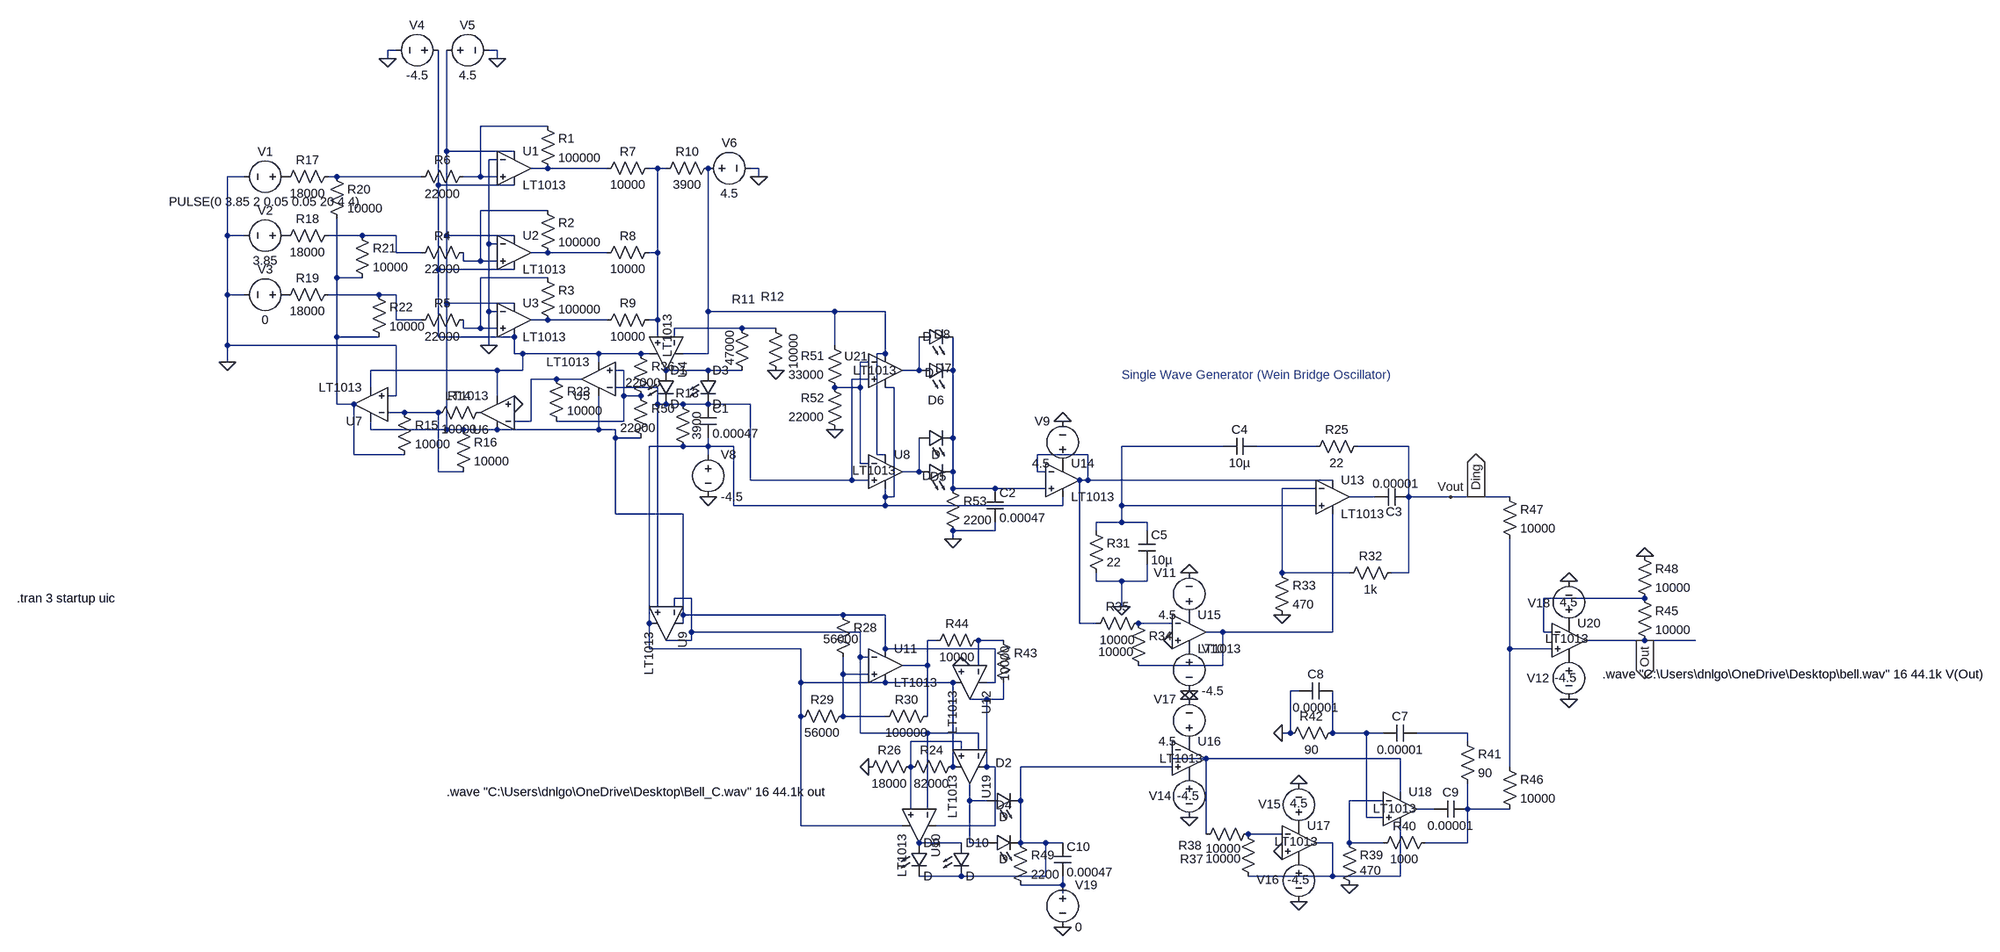
[diagram p0: schematic Project_2_C.asc]
Project_2_C.asc, the LTspice schematic file:
Version 4
SHEET 1 2804 1236
WIRE -336 -640 -352 -640
WIRE -144 -640 -160 -640
WIRE -352 -624 -352 -640
WIRE -144 -624 -144 -640
WIRE -48 -496 -176 -496
WIRE -240 -448 -240 -640
WIRE -112 -448 -240 -448
WIRE -144 -432 -160 -432
WIRE -48 -416 -80 -416
WIRE 64 -416 -48 -416
WIRE 160 -416 144 -416
WIRE 176 -416 160 -416
WIRE 352 -416 336 -416
WIRE -624 -400 -656 -400
WIRE -448 -400 -464 -400
WIRE -288 -400 -448 -400
WIRE -176 -400 -176 -496
WIRE -176 -400 -208 -400
WIRE -144 -400 -176 -400
WIRE 352 -400 352 -416
WIRE -256 -384 -256 -640
WIRE -112 -384 -256 -384
WIRE -48 -336 -176 -336
WIRE -656 -288 -656 -400
WIRE -624 -288 -656 -288
WIRE -400 -288 -464 -288
WIRE -336 -288 -400 -288
WIRE -240 -288 -240 -448
WIRE -112 -288 -240 -288
WIRE -160 -272 -160 -432
WIRE -144 -272 -160 -272
WIRE -336 -256 -336 -288
WIRE -288 -256 -336 -256
WIRE -48 -256 -80 -256
WIRE 64 -256 -48 -256
WIRE 160 -256 160 -416
WIRE 160 -256 144 -256
WIRE -208 -240 -208 -256
WIRE -176 -240 -176 -336
WIRE -176 -240 -208 -240
WIRE -144 -240 -176 -240
WIRE -256 -224 -256 -384
WIRE -112 -224 -256 -224
WIRE -448 -208 -448 -320
WIRE -400 -208 -448 -208
WIRE -48 -208 -176 -208
WIRE -656 -176 -656 -288
WIRE -624 -176 -656 -176
WIRE -368 -176 -464 -176
WIRE -336 -176 -368 -176
WIRE -240 -160 -240 -288
WIRE -112 -160 -240 -160
WIRE -160 -144 -160 -272
WIRE -144 -144 -160 -144
WIRE 256 -144 256 -416
WIRE 496 -144 256 -144
WIRE 592 -144 496 -144
WIRE -336 -128 -336 -176
WIRE -288 -128 -336 -128
WIRE -48 -128 -80 -128
WIRE 64 -128 -48 -128
WIRE 160 -128 160 -256
WIRE 160 -128 144 -128
WIRE -208 -112 -208 -128
WIRE -176 -112 -176 -208
WIRE -176 -112 -208 -112
WIRE -144 -112 -176 -112
WIRE 320 -112 192 -112
WIRE 384 -112 320 -112
WIRE -448 -96 -448 -208
WIRE -368 -96 -448 -96
WIRE -256 -96 -256 -224
WIRE -112 -96 -256 -96
WIRE 160 -96 160 -128
WIRE 192 -96 192 -112
WIRE -656 -80 -656 -176
WIRE -336 -80 -656 -80
WIRE -160 -80 -160 -144
WIRE 496 -80 496 -144
WIRE -112 -64 -112 -96
WIRE -96 -64 -112 -64
WIRE 48 -64 -96 -64
WIRE 128 -64 48 -64
WIRE 144 -64 128 -64
WIRE 256 -64 256 -144
WIRE 256 -64 208 -64
WIRE 592 -64 592 -144
WIRE 592 -64 576 -64
WIRE -656 -48 -656 -80
WIRE 48 -48 48 -64
WIRE 560 -48 544 -48
WIRE -144 -32 -384 -32
WIRE -96 -32 -96 -64
WIRE -96 -32 -144 -32
WIRE 96 -32 80 -32
WIRE 256 -32 176 -32
WIRE 320 -32 256 -32
WIRE 656 -32 656 -96
WIRE 656 -32 624 -32
WIRE 720 -32 720 -96
WIRE -32 -16 -80 -16
WIRE 16 -16 -32 -16
WIRE 560 -16 528 -16
WIRE -384 0 -384 -32
WIRE 160 0 80 0
WIRE 544 0 544 -48
WIRE 544 0 496 0
WIRE 608 0 592 0
WIRE -336 16 -336 -80
WIRE -336 16 -352 16
WIRE -144 16 -144 -32
WIRE 96 16 96 -32
WIRE 128 16 96 16
WIRE -448 32 -448 -96
WIRE -416 32 -448 32
WIRE 160 32 160 0
WIRE 176 32 160 32
WIRE 208 32 176 32
WIRE 256 32 208 32
WIRE 336 32 256 32
WIRE -320 48 -352 48
WIRE -256 48 -320 48
WIRE -80 64 -80 -16
WIRE -80 64 -112 64
WIRE 96 64 96 16
WIRE 96 64 -32 64
WIRE -384 80 -384 64
WIRE -240 80 -240 -160
WIRE -240 80 -384 80
WIRE -208 80 -240 80
WIRE -144 80 -208 80
WIRE 48 80 48 16
WIRE 48 80 -144 80
WIRE 80 80 48 80
WIRE 80 96 80 80
WIRE 128 96 80 96
WIRE 720 96 720 -32
WIRE 208 112 144 112
WIRE 256 112 256 96
WIRE 256 112 208 112
WIRE 304 112 256 112
WIRE 1232 112 1040 112
WIRE 1408 112 1296 112
WIRE 1584 112 1488 112
WIRE -416 128 -416 32
WIRE -320 128 -416 128
WIRE 256 128 256 112
WIRE 576 128 576 -64
WIRE 592 128 576 128
WIRE 976 128 880 128
WIRE 544 144 544 0
WIRE 560 144 544 144
WIRE -256 160 -256 48
WIRE -208 160 -256 160
WIRE 656 160 656 96
WIRE 656 160 624 160
WIRE 720 160 720 96
WIRE 880 160 880 128
WIRE 896 160 880 160
WIRE 336 176 336 32
WIRE 528 176 528 -16
WIRE 528 176 336 176
WIRE 560 176 528 176
WIRE 976 176 976 128
WIRE 976 176 960 176
WIRE 1440 176 976 176
WIRE 720 192 720 160
WIRE 800 192 720 192
WIRE 896 192 800 192
WIRE 1408 192 1344 192
WIRE 592 208 592 192
WIRE 608 208 608 0
WIRE 608 208 592 208
WIRE 1520 208 1472 208
WIRE 1584 208 1584 112
WIRE 1664 208 1584 208
WIRE 1712 208 1664 208
WIRE 1776 208 1712 208
WIRE 304 224 304 112
WIRE 592 224 592 208
WIRE 592 224 304 224
WIRE 928 224 928 208
WIRE 928 224 592 224
WIRE 1040 224 1040 112
WIRE 1408 224 1040 224
WIRE 80 240 80 96
WIRE 208 240 80 240
WIRE 1040 256 1040 224
WIRE 1040 256 992 256
WIRE 1088 256 1040 256
WIRE 800 272 800 256
WIRE 800 272 720 272
WIRE 992 272 992 256
WIRE 1088 272 1088 256
WIRE 720 288 720 272
WIRE 1344 352 1344 192
WIRE 1472 352 1344 352
WIRE 1584 352 1584 208
WIRE 1584 352 1552 352
WIRE 992 368 992 352
WIRE 1040 368 992 368
WIRE 1088 368 1088 336
WIRE 1088 368 1040 368
WIRE 224 400 192 400
WIRE 2032 400 1840 400
WIRE 160 416 160 32
WIRE 192 416 192 400
WIRE 1040 416 1040 368
WIRE 208 432 208 240
WIRE 512 432 208 432
WIRE 592 432 512 432
WIRE 144 448 144 112
WIRE 208 448 208 432
WIRE 960 448 960 176
WIRE 992 448 960 448
WIRE 1136 448 1072 448
WIRE 224 464 224 400
WIRE 544 464 224 464
WIRE 1232 464 1200 464
WIRE 1440 464 1440 240
WIRE 1440 464 1232 464
WIRE 1840 464 1840 400
WIRE 1856 464 1840 464
WIRE 224 480 224 464
WIRE 224 480 176 480
WIRE 688 480 672 480
WIRE 816 480 768 480
WIRE 2032 480 1920 480
WIRE 2128 480 2032 480
WIRE 144 496 144 448
WIRE 432 496 144 496
WIRE 592 496 592 432
WIRE 800 496 592 496
WIRE 1776 496 1776 288
WIRE 1856 496 1776 496
WIRE 544 512 544 464
WIRE 560 512 544 512
WIRE 672 528 672 480
WIRE 672 528 624 528
WIRE 768 528 768 480
WIRE 1232 528 1232 464
WIRE 1232 528 1072 528
WIRE 512 544 512 512
WIRE 560 544 512 544
WIRE 432 560 432 496
WIRE 592 560 432 560
WIRE 720 560 592 560
WIRE 800 560 800 496
WIRE 800 560 784 560
WIRE 1376 576 1360 576
WIRE 784 592 752 592
WIRE 816 592 816 560
WIRE 816 592 784 592
WIRE 432 624 432 560
WIRE 512 624 512 544
WIRE 592 624 512 624
WIRE 672 624 672 528
WIRE 544 656 544 512
WIRE 672 656 544 656
WIRE 768 656 672 656
WIRE 1360 656 1360 576
WIRE 1360 656 1344 656
WIRE 1440 656 1440 576
WIRE 1504 656 1440 656
WIRE 1536 656 1504 656
WIRE 1696 656 1600 656
WIRE 736 672 640 672
WIRE 1696 672 1696 656
WIRE 736 688 736 672
WIRE 768 688 768 656
WIRE 1136 704 1136 688
WIRE 1200 704 1136 704
WIRE 1568 704 1200 704
WIRE 640 720 640 672
WIRE 720 720 720 560
WIRE 784 720 784 592
WIRE 800 720 784 720
WIRE 1136 720 848 720
WIRE 1776 720 1776 496
WIRE 1568 768 1568 704
WIRE 752 784 752 752
WIRE 784 784 752 784
WIRE 848 784 848 720
WIRE 1536 784 1472 784
WIRE 640 800 640 720
WIRE 672 800 672 656
WIRE 1632 800 1600 800
WIRE 1696 800 1696 752
WIRE 1776 800 1696 800
WIRE 1504 816 1504 656
WIRE 1536 816 1504 816
WIRE 432 832 432 624
WIRE 624 832 432 832
WIRE 800 832 800 720
WIRE 800 832 688 832
WIRE 1200 848 1200 704
WIRE 1344 848 1280 848
WIRE 736 864 656 864
WIRE 752 864 752 784
WIRE 784 864 752 864
WIRE 848 864 848 784
WIRE 896 864 848 864
WIRE 928 864 896 864
WIRE 1440 864 1408 864
WIRE 1472 864 1472 784
WIRE 1536 864 1472 864
WIRE 1696 864 1696 800
WIRE 1696 864 1616 864
WIRE 736 928 656 928
WIRE 896 928 896 864
WIRE 896 928 736 928
WIRE 1440 928 1440 864
WIRE 1440 928 1280 928
WIRE 1568 928 1568 832
WIRE 1568 928 1440 928
WIRE 928 944 928 928
WIRE 928 944 848 944
WIRE 928 960 928 944
FLAG -656 -48 0
FLAG -352 -624 0
FLAG -144 -624 0
FLAG -160 -80 0
FLAG 352 -400 0
FLAG 384 -32 0
FLAG 256 208 0
FLAG 1040 416 0
FLAG 1344 432 0
FLAG 1664 208 Vout
FLAG 928 64 0
FLAG 1168 576 0
FLAG 1168 352 0
FLAG 1136 480 0
FLAG 1168 592 0
FLAG 1472 944 0
FLAG 1344 656 0
FLAG 736 528 0
FLAG 1888 592 0
FLAG 1888 368 0
FLAG 2032 320 0
FLAG 1168 816 0
FLAG 1376 752 0
FLAG 1376 976 0
FLAG 1344 880 0
FLAG 928 1024 0
FLAG 2032 480 Out
IOPIN 2032 480 Out
FLAG -112 32 0
FLAG 1712 208 Ding
IOPIN 1712 208 Out
FLAG 496 80 0
FLAG 720 288 0
FLAG 560 720 0
DATAFLAG 160 208 ""
SYMBOL voltage -528 -400 R90
WINDOW 0 -32 56 VBottom 2
WINDOW 3 32 56 VTop 2
WINDOW 123 0 0 Left 0
WINDOW 39 0 0 Left 0
SYMATTR InstName V1
SYMATTR Value PULSE(0 3.85 2 0.05 0.05 20 4 4)
SYMBOL voltage -528 -288 R90
WINDOW 0 -32 56 VBottom 2
WINDOW 3 32 56 VTop 2
WINDOW 123 0 0 Left 0
WINDOW 39 0 0 Left 0
SYMATTR InstName V2
SYMATTR Value 3.85
SYMBOL voltage -528 -176 R90
WINDOW 0 -32 56 VBottom 2
WINDOW 3 32 56 VTop 2
SYMATTR InstName V3
SYMATTR Value 0
SYMBOL OpAmps\\LT1013 -112 -480 R0
SYMATTR InstName U1
SYMBOL OpAmps\\LT1013 -112 -320 R0
SYMATTR InstName U2
SYMBOL OpAmps\\LT1013 -112 -192 R0
SYMATTR InstName U3
SYMBOL voltage -240 -640 R90
WINDOW 0 -32 56 VBottom 2
WINDOW 3 32 56 VTop 2
WINDOW 123 0 0 Left 0
WINDOW 39 0 0 Left 0
SYMATTR InstName V4
SYMATTR Value -4.5
SYMBOL voltage -256 -640 R270
WINDOW 0 32 56 VTop 2
WINDOW 3 -32 56 VBottom 2
WINDOW 123 0 0 Left 0
WINDOW 39 0 0 Left 0
SYMATTR InstName V5
SYMATTR Value 4.5
SYMBOL res -64 -512 R0
SYMATTR InstName R1
SYMATTR Value 100000
SYMBOL res -64 -352 R0
SYMATTR InstName R2
SYMATTR Value 100000
SYMBOL res -64 -224 R0
SYMATTR InstName R3
SYMATTR Value 100000
SYMBOL res -192 -272 R90
WINDOW 0 0 56 VBottom 2
WINDOW 3 32 56 VTop 2
SYMATTR InstName R4
SYMATTR Value 22000
SYMBOL res -192 -144 R90
WINDOW 0 0 56 VBottom 2
WINDOW 3 32 56 VTop 2
SYMATTR InstName R5
SYMATTR Value 22000
SYMBOL res -192 -416 R90
WINDOW 0 0 56 VBottom 2
WINDOW 3 33 56 VTop 2
SYMATTR InstName R6
SYMATTR Value 22000
SYMBOL res 160 -432 R90
WINDOW 0 0 56 VBottom 2
WINDOW 3 32 56 VTop 2
SYMATTR InstName R7
SYMATTR Value 10000
SYMBOL res 160 -272 R90
WINDOW 0 0 56 VBottom 2
WINDOW 3 32 56 VTop 2
SYMATTR InstName R8
SYMATTR Value 10000
SYMBOL res 160 -144 R90
WINDOW 0 0 56 VBottom 2
WINDOW 3 32 56 VTop 2
SYMATTR InstName R9
SYMATTR Value 10000
SYMBOL res 272 -432 R90
WINDOW 0 0 56 VBottom 2
WINDOW 3 32 56 VTop 2
SYMATTR InstName R10
SYMATTR Value 3900
SYMBOL voltage 240 -416 R270
WINDOW 0 32 56 VTop 2
WINDOW 3 -32 56 VBottom 2
SYMATTR InstName V6
SYMATTR Value 4.5
SYMBOL OpAmps\\LT1013 240 -64 R90
WINDOW 3 -75 61 Left 2
SYMATTR InstName U4
SYMBOL res 336 -16 R180
WINDOW 0 -9 151 Left 2
WINDOW 3 39 93 VLeft 2
SYMATTR InstName R11
SYMATTR Value 47000
SYMBOL res 400 -16 R180
WINDOW 0 0 156 Left 2
WINDOW 3 -18 86 VLeft 2
SYMATTR InstName R12
SYMATTR Value 10000
SYMBOL cap 240 32 R0
SYMATTR InstName C1
SYMATTR Value 0.00047
SYMBOL res 192 16 R0
WINDOW 0 2 -5 Left 2
WINDOW 3 43 84 VLeft 2
SYMATTR InstName R13
SYMATTR Value 3900
SYMBOL OpAmps\\LT1013 -384 96 R180
SYMATTR InstName U7
SYMBOL res -336 32 R0
SYMATTR InstName R15
SYMATTR Value 10000
SYMBOL res -224 64 R0
SYMATTR InstName R16
SYMATTR Value 10000
SYMBOL res -448 -416 R90
WINDOW 0 0 56 VBottom 2
WINDOW 3 32 56 VTop 2
SYMATTR InstName R17
SYMATTR Value 18000
SYMBOL res -448 -304 R90
WINDOW 0 0 56 VBottom 2
WINDOW 3 32 56 VTop 2
SYMATTR InstName R18
SYMATTR Value 18000
SYMBOL res -448 -192 R90
WINDOW 0 0 56 VBottom 2
WINDOW 3 32 56 VTop 2
SYMATTR InstName R19
SYMATTR Value 18000
SYMBOL res -464 -416 R0
SYMATTR InstName R20
SYMATTR Value 10000
SYMBOL res -416 -304 R0
SYMATTR InstName R21
SYMATTR Value 10000
SYMBOL res -384 -192 R0
SYMATTR InstName R22
SYMATTR Value 10000
SYMBOL voltage 256 112 R0
SYMATTR InstName V8
SYMATTR Value -4.5
SYMBOL OpAmps\\LT1013 240 448 R90
SYMATTR InstName U9
SYMBOL cap 1296 96 R90
WINDOW 0 0 32 VBottom 2
WINDOW 3 32 32 VTop 2
SYMATTR InstName C4
SYMATTR Value 10µ
SYMBOL res 1504 96 R90
WINDOW 0 0 56 VBottom 2
WINDOW 3 32 56 VTop 2
SYMATTR InstName R25
SYMATTR Value 22
SYMBOL cap 1072 272 R0
SYMATTR InstName C5
SYMATTR Value 10µ
SYMBOL res 976 256 R0
SYMATTR InstName R31
SYMATTR Value 22
SYMBOL res 1568 336 R90
WINDOW 0 0 56 VBottom 2
WINDOW 3 32 56 VTop 2
SYMATTR InstName R32
SYMATTR Value 1k
SYMBOL OpAmps\\LT1013 1440 144 R0
SYMATTR InstName U13
SYMBOL OpAmps\\LT1013 928 112 R0
SYMATTR InstName U14
SYMBOL voltage 928 160 R180
WINDOW 0 24 96 Left 2
WINDOW 3 24 16 Left 2
SYMATTR InstName V9
SYMATTR Value 4.5
SYMBOL OpAmps\\LT1013 1168 400 R0
SYMATTR InstName U15
SYMBOL voltage 1168 480 R0
SYMATTR InstName V10
SYMATTR Value -4.5
SYMBOL voltage 1168 448 R180
WINDOW 0 24 96 Left 2
WINDOW 3 24 16 Left 2
SYMATTR InstName V11
SYMATTR Value 4.5
SYMBOL res 1328 336 R0
SYMATTR InstName R33
SYMATTR Value 470
SYMBOL res 1056 432 R0
WINDOW 3 -60 70 Left 2
SYMATTR Value 10000
SYMATTR InstName R34
SYMBOL res 1088 432 R90
WINDOW 0 0 56 VBottom 2
WINDOW 3 32 56 VTop 2
SYMATTR InstName R35
SYMATTR Value 10000
SYMBOL OpAmps\\LT1013 1168 640 R0
WINDOW 3 -56 64 Left 2
SYMATTR InstName U16
SYMBOL voltage 1168 688 R180
WINDOW 0 24 96 Left 2
WINDOW 3 24 16 Left 2
WINDOW 123 0 0 Left 0
WINDOW 39 0 0 Left 0
SYMATTR InstName V17
SYMATTR Value 4.5
SYMBOL res 1456 848 R0
WINDOW 3 36 69 Left 2
SYMATTR Value 470
SYMATTR InstName R39
SYMBOL res 1632 848 R90
WINDOW 0 0 56 VBottom 2
WINDOW 3 32 56 VTop 2
SYMATTR InstName R40
SYMATTR Value 1000
SYMBOL res 1680 656 R0
SYMATTR InstName R41
SYMATTR Value 90
SYMBOL cap 1600 640 R90
WINDOW 0 0 32 VBottom 2
WINDOW 3 32 32 VTop 2
SYMATTR InstName C7
SYMATTR Value 0.00001
SYMBOL cap 1440 560 R90
WINDOW 0 0 32 VBottom 2
WINDOW 3 32 32 VTop 2
SYMATTR InstName C8
SYMATTR Value 0.00001
SYMBOL res 1456 640 R90
WINDOW 0 0 56 VBottom 2
WINDOW 3 32 56 VTop 2
SYMATTR InstName R42
SYMATTR Value 90
SYMBOL OpAmps\\LT1013 592 464 R0
SYMATTR InstName U11
SYMBOL res 496 416 R0
WINDOW 3 -22 62 Left 2
SYMATTR Value 56000
SYMATTR InstName R28
SYMBOL res 688 608 R90
WINDOW 0 0 56 VBottom 2
WINDOW 3 32 56 VTop 2
SYMATTR InstName R30
SYMATTR Value 100000
SYMBOL res 528 608 R90
WINDOW 0 0 56 VBottom 2
WINDOW 3 32 56 VTop 2
SYMATTR InstName R29
SYMATTR Value 56000
SYMBOL OpAmps\\LT1013 816 560 R90
SYMATTR InstName U12
SYMBOL res 800 464 R0
WINDOW 3 19 94 VLeft 2
SYMATTR Value 10000
SYMATTR InstName R43
SYMBOL res 784 464 R90
WINDOW 0 0 56 VBottom 2
WINDOW 3 32 56 VTop 2
SYMATTR InstName R44
SYMATTR Value 10000
SYMBOL OpAmps\\LT1013 816 720 R90
SYMATTR InstName U19
SYMBOL OpAmps\\LT1013 1888 416 R0
WINDOW 3 -45 61 Left 2
SYMATTR InstName U20
SYMBOL voltage 1888 496 R0
WINDOW 0 -80 56 Left 2
WINDOW 3 -27 55 Left 2
SYMATTR InstName V12
SYMATTR Value -4.5
SYMBOL voltage 1888 464 R180
WINDOW 0 35 55 Left 2
WINDOW 3 -17 56 Left 2
SYMATTR InstName V18
SYMATTR Value 4.5
SYMBOL res 1760 704 R0
SYMATTR InstName R46
SYMATTR Value 10000
SYMBOL res 1760 192 R0
SYMATTR InstName R47
SYMATTR Value 10000
SYMBOL res 2016 384 R0
SYMATTR InstName R45
SYMATTR Value 10000
SYMBOL res 2016 304 R0
SYMATTR InstName R48
SYMATTR Value 10000
SYMBOL cap 1584 192 R90
WINDOW 0 60 28 VBottom 2
WINDOW 3 -25 24 VTop 2
SYMATTR InstName C3
SYMATTR Value 0.00001
SYMBOL OpAmps\\LT1013 1568 736 R0
WINDOW 3 -51 63 Left 2
SYMATTR InstName U18
SYMBOL cap 1696 784 R90
WINDOW 0 0 32 VBottom 2
WINDOW 3 32 32 VTop 2
SYMATTR InstName C9
SYMATTR Value 0.00001
SYMBOL voltage 1168 720 R0
WINDOW 0 -76 55 Left 2
WINDOW 3 -23 55 Left 2
SYMATTR InstName V14
SYMATTR Value -4.5
SYMBOL OpAmps\\LT1013 1376 800 R0
WINDOW 3 -46 62 Left 2
SYMATTR InstName U17
SYMBOL voltage 1376 848 R180
WINDOW 0 34 57 Left 2
WINDOW 3 -17 59 Left 2
WINDOW 123 0 0 Left 0
WINDOW 39 0 0 Left 0
SYMATTR InstName V15
SYMATTR Value 4.5
SYMBOL voltage 1376 880 R0
WINDOW 0 -80 54 Left 2
WINDOW 3 -22 54 Left 2
SYMATTR InstName V16
SYMATTR Value -4.5
SYMBOL res 1264 832 R0
WINDOW 3 -65 62 Left 2
WINDOW 0 -113 63 Left 2
SYMATTR Value 10000
SYMATTR InstName R37
SYMBOL res 1184 864 R270
WINDOW 0 -21 -14 VTop 2
WINDOW 3 4 49 VBottom 2
SYMATTR InstName R38
SYMATTR Value 10000
SYMBOL res 832 848 R0
SYMATTR InstName R49
SYMATTR Value 2200
SYMBOL cap 912 864 R0
SYMATTR InstName C10
SYMATTR Value 0.00047
SYMBOL voltage 928 928 R0
SYMATTR InstName V19
SYMATTR Value 0
SYMBOL LED 784 800 R270
WINDOW 0 72 32 VTop 2
WINDOW 3 0 32 VBottom 2
SYMATTR InstName D2
SYMBOL LED 784 880 R270
WINDOW 0 72 32 VTop 2
WINDOW 3 0 32 VBottom 2
SYMATTR InstName D4
SYMBOL LED 160 -32 R0
SYMATTR InstName D1
SYMBOL LED 240 -32 R0
SYMATTR InstName D3
SYMBOL res -160 32 R90
WINDOW 0 0 56 VBottom 2
WINDOW 3 32 56 VTop 2
SYMATTR InstName R14
SYMATTR Value 10000
SYMBOL OpAmps\\LT1013 -144 112 R180
SYMATTR InstName U6
SYMBOL res -48 -32 R0
SYMATTR InstName R23
SYMATTR Value 10000
SYMBOL OpAmps\\LT1013 48 48 R180
SYMATTR InstName U5
SYMBOL res 112 -80 R0
WINDOW 3 -13 71 Left 2
SYMATTR InstName R36
SYMATTR Value 22000
SYMBOL res 112 0 R0
WINDOW 3 -23 77 Left 2
SYMATTR InstName R50
SYMATTR Value 22000
SYMBOL OpAmps\\LT1013 592 96 R0
WINDOW 3 -63 62 Left 2
SYMATTR InstName U8
SYMBOL res 512 16 R180
WINDOW 0 36 76 Left 2
WINDOW 3 36 40 Left 2
SYMATTR InstName R51
SYMATTR Value 33000
SYMBOL res 512 96 R180
WINDOW 0 36 76 Left 2
WINDOW 3 36 40 Left 2
SYMATTR InstName R52
SYMATTR Value 22000
SYMBOL LED 656 176 R270
WINDOW 0 -9 36 VTop 2
WINDOW 3 24 14 VBottom 2
SYMATTR InstName D5
SYMBOL cap 784 192 R0
SYMATTR InstName C2
SYMATTR Value 0.00047
SYMBOL res 704 176 R0
SYMATTR InstName R53
SYMATTR Value 2200
SYMBOL LED 656 112 R270
WINDOW 0 72 32 VTop 2
WINDOW 3 0 32 VBottom 2
SYMATTR InstName D6
SYMBOL OpAmps\\LT1013 592 -96 R0
WINDOW 0 -78 37 Left 2
WINDOW 3 -61 64 Left 2
SYMATTR InstName U21
SYMBOL LED 656 -80 R270
WINDOW 0 -59 46 VTop 2
WINDOW 3 32 15 VBottom 2
SYMATTR InstName D7
SYMBOL LED 656 -16 R270
WINDOW 0 69 44 VTop 2
WINDOW 3 28 19 VBottom 2
SYMATTR InstName D8
SYMBOL res 736 704 R90
WINDOW 0 0 56 VBottom 2
WINDOW 3 32 56 VTop 2
SYMATTR InstName R24
SYMATTR Value 82000
SYMBOL res 656 704 R90
WINDOW 0 0 56 VBottom 2
WINDOW 3 32 56 VTop 2
SYMATTR InstName R26
SYMATTR Value 18000
SYMBOL OpAmps\\LT1013 720 832 R90
SYMATTR InstName U10
SYMBOL LED 640 864 R0
SYMATTR InstName D9
SYMBOL LED 720 864 R0
SYMATTR InstName D10
TEXT 1040 -24 Left 2 ;Single Wave Generator (Wein Bridge Oscillator)
TEXT -1080 400 Left 2 !.tran 3 startup uic
TEXT 1952 544 Left 2 !.wave "C:\\Users\\dnlgo\\OneDrive\\Desktop\\bell.wav" 16 44.1k V(Out)
TEXT -240 768 Left 2 !.wave "C:\\Users\\dnlgo\\OneDrive\\Desktop\\Bell_C.wav" 16 44.1k out

The netlist it stands for:
* Project_2_C.asc
V1 P001 0 PULSE(0 3.85 2 0.05 0.05 20 4 4)
V2 P002 0 3.85
V3 P003 0 0
XU1 N001 0 N002 N006 N003 LT1013  ; pins In+ In- V+ V- OUT
XU2 N007 0 N002 N006 N009 LT1013  ; pins In+ In- V+ V- OUT
XU3 N011 0 N002 N006 N014 LT1013  ; pins In+ In- V+ V- OUT
V4 N006 0 -4.5
V5 N002 0 4.5
R1 N001 N003 100000
R2 N007 N009 100000
R3 N011 N014 100000
R4 N007 N008 22000
R5 N011 N012 22000
R6 N001 N005 22000
R7 N004 N003 10000
R8 N004 N009 10000
R9 N004 N014 10000
R10 N013 N004 3900
V6 N013 0 4.5
XU4 N004 N015 N013 N006 N018 LT1013  ; pins In+ In- V+ V- OUT
R11 N018 N015 47000
R12 0 N015 10000
C1 N022 N023 0.00047
R13 N022 N023 3900
XU7 0 N024 N002 N006 N010 LT1013  ; pins In+ In- V+ V- OUT
R15 N024 N010 10000
R16 N002 N024 10000
R17 N005 P001 18000
R18 N008 P002 18000
R19 N012 P003 18000
R20 N005 N010 10000
R21 N008 N010 10000
R22 N012 N010 10000
V8 N023 0 -4.5
XU9 N022 N031 N002 N023 N031 LT1013  ; pins In+ In- V+ V- OUT
C4 N026 N025 10µ
R25 Ding N026 22
C5 N025 0 10µ
R31 N025 0 22
R32 Ding N029 1k
XU13 N025 N029 N027 N034 N030 LT1013  ; pins In+ In- V+ V- OUT
XU14 N020 N027 P004 N023 N027 LT1013  ; pins In+ In- V+ V- OUT
V9 P004 0 4.5
XU15 0 N033 P005 P006 N034 LT1013  ; pins In+ In- V+ V- OUT
V10 P006 0 -4.5
V11 P005 0 4.5
R33 N029 0 470
R34 N033 N034 10000
R35 N033 N027 10000
XU16 N044 N043 P007 P008 N043 LT1013  ; pins In+ In- V+ V- OUT
V17 P007 0 4.5
R39 N046 0 470
R40 N048 N046 1000
R41 N041 N048 90
C7 N041 N040 0.00001
C8 N040 0 0.00001
R42 N040 0 90
XU11 N038 N031 N002 N023 N035 LT1013  ; pins In+ In- V+ V- OUT
R28 N002 N038 56000
R30 N035 N038 100000
R29 N038 N023 56000
XU12 0 N036 N002 N023 N039 LT1013  ; pins In+ In- V+ V- OUT
R43 N036 N039 10000
R44 N036 N035 10000
XU19 N042 N031 N039 N023 N045 LT1013  ; pins In+ In- V+ V- OUT
XU20 N037 N032 P009 P010 Out LT1013  ; pins In+ In- V+ V- OUT
V12 P010 0 -4.5
V18 P009 0 4.5
R46 N037 N048 10000
R47 Ding N037 10000
R45 N032 Out 10000
R48 0 N032 10000
C3 Ding N030 0.00001
XU18 N040 N046 N043 N051 N047 LT1013  ; pins In+ In- V+ V- OUT
C9 N048 N047 0.00001
V14 P008 0 -4.5
XU17 0 N049 P011 P012 N051 LT1013  ; pins In+ In- V+ V- OUT
V15 P011 0 4.5
V16 P012 0 -4.5
R37 N049 N051 10000
R38 N043 N049 10000
R49 N044 N052 2200
C10 N044 N052 0.00047
V19 N052 0 0
D2 N045 N044 D
D4 N045 N044 D
D1 N018 N022 D
D3 N018 N022 D
R14 P013 N024 10000
XU6 0 N021 N002 N006 P013 LT1013  ; pins In+ In- V+ V- OUT
R23 N021 N017 10000
XU5 N017 N022 N002 N006 N021 LT1013  ; pins In+ In- V+ V- OUT
R36 N006 N017 22000
R50 N017 N002 22000
XU8 N022 N016 N013 N023 N028 LT1013  ; pins In+ In- V+ V- OUT
R51 N016 N013 33000
R52 0 N016 22000
D5 N028 N020 D
C2 N020 0 0.00047
R53 N020 0 2200
D6 N028 N020 D
XU21 N022 N016 N013 N023 N019 LT1013  ; pins In+ In- V+ V- OUT
D7 N019 N020 D
D8 N019 N020 D
R24 N023 N042 82000
R26 N042 0 18000
XU10 N042 N031 N039 N023 N050 LT1013  ; pins In+ In- V+ V- OUT
D9 N050 N044 D
D10 N050 N044 D
.model D D
.lib standard.dio
* Single Wave Generator (Wein Bridge Oscillator)
.tran 3 startup uic
.wave "C:\Users\dnlgo\OneDrive\Desktop\bell.wav" 16 44.1k V(Out)
.wave "C:\Users\dnlgo\OneDrive\Desktop\Bell_C.wav" 16 44.1k out
.lib LTC.lib
.backanno
.end